# Altium schematic sheet dipping.SchDoc
size A4; SheetNumber: 1; SheetTotal: 1
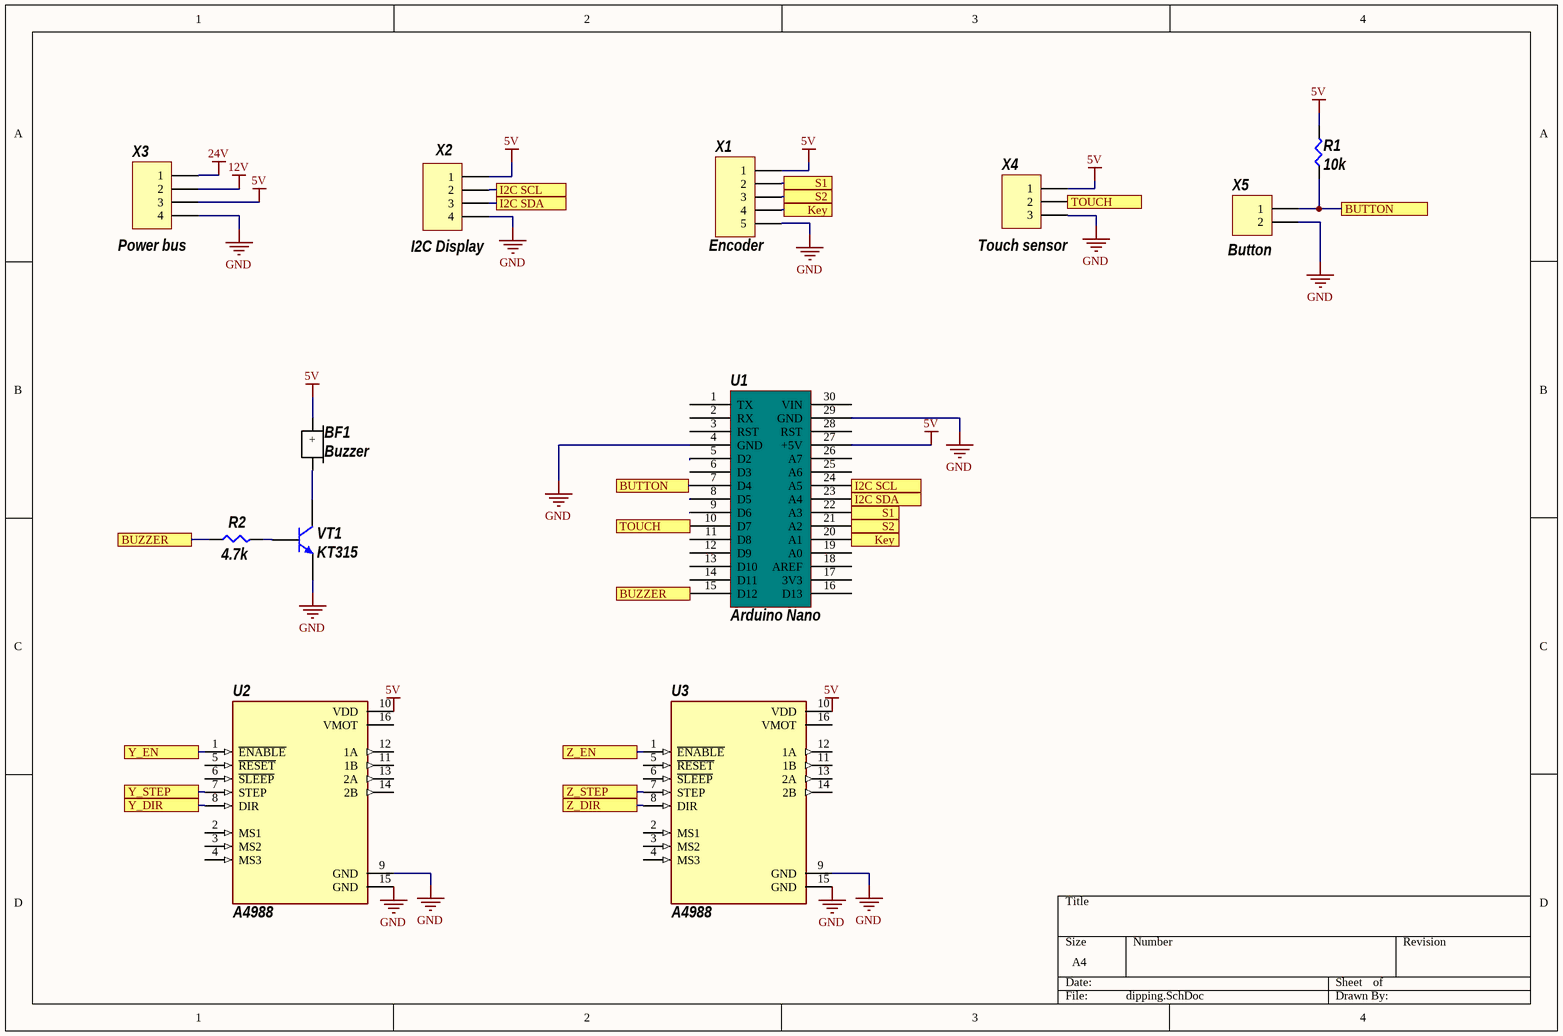
[diagram p0: dipping.SchDoc]

## Parts
BF1  Buzzer  [BUZZER]
R1  10k  [SMD-0805-RES]
R2  4.7k  [SMD-0805-RES]
U1  Arduino Nano  [Arduino_Nano_Extended]
U2  A4988  [UNI_STEPPER_MOTOR_DRIVER_CARRIER]
U3  A4988  [UNI_STEPPER_MOTOR_DRIVER_CARRIER]
VT1  KT315  [TO92]
X1  Encoder  [X_5pins_simplified]
X2  I2C Display  [X_4pins_simplified]
X3  Power bus  [POWER_BUS]
X4  Touch sensor  [X_3pins_simplified]
X5  Button  [X_2pins_5mm]

## Ports
BUTTON, BUZZER, I2C SCL, I2C SDA, Key, S1, S2, TOUCH, Y_DIR, Y_EN, Y_STEP, Z_DIR, Z_EN, Z_STEP

## Nets
5V: BF1.1(+) R1.2 U1.27(+5V) U2.10(VDD) U3.10(VDD) X1.1 X2.1 X3.3 X4.1
12V: X3.2
24V: X3.1
GND: U1.4(GND) U1.29(GND) U2.9(GND) U2.15(GND) U3.9(GND) U3.15(GND) VT1.2(E) X1.5 X2.4 X3.4 X4.3 X5.2
BUTTON: R1.1 U1.7(D4) X5.1 ; port BUTTON
BUZZER: R2.1 U1.15(D12) ; port BUZZER
I2C SCL: U1.24(A5) X2.2 ; port I2C SCL
I2C SDA: U1.23(A4) X2.3 ; port I2C SDA
Key: U1.20(A1) X1.4 ; port Key
S1: U1.22(A3) X1.2 ; port S1
S2: U1.21(A2) X1.3 ; port S2
TOUCH: U1.10(D7) X4.2 ; port TOUCH
Y_DIR: U2.8(DIR) ; port Y_DIR
Y_EN: U2.1(~{ENABLE}) ; port Y_EN
Y_STEP: U2.7(STEP) ; port Y_STEP
Z_DIR: U3.8(DIR) ; port Z_DIR
Z_EN: U3.1(~{ENABLE}) ; port Z_EN
Z_STEP: U3.7(STEP) ; port Z_STEP
NetBF1_2: BF1.2 VT1.3(C)
NetR2_2: R2.2 VT1.1(B)

Not connected (* = marked no-connect by the designer): U1 1(TX) 2(RX) 3(RST) 5(D2) 6(D3) 8(D5) 9(D6) 11(D8) 12(D9) 13(D10) 14(D11) 16(D13) 17(3V3) 18(AREF) 19(A0) 25(A6) 26(A7) 28(RST) 30(VIN); U2 2(MS1) 3(MS2) 4(MS3) 5(~{RESET}) 6(~{SLEEP}) 11(1B) 12(1A) 13(2A) 14(2B) 16(VMOT); U3 2(MS1) 3(MS2) 4(MS3) 5(~{RESET}) 6(~{SLEEP}) 11(1B) 12(1A) 13(2A) 14(2B) 16(VMOT)

## Library data of the parts
BF1 = BF_BUZZER: Value: Buzzer
R1 R2 = ERJ-P06J222V: RES SMD 2.2K OHM 5% 1/2W 0805; Manufacturer: Panasonic Electronic Components; Factory Stock: 0; Unit Price (USD): 0.01839; @ qty: 1500; Minimum Quantity: 1; Power (Watts): 0.5W, 1/2W; Temperature Coefficient: ±200ppm/°C; Part Number: ERJ-P06J222V; Datasheets: https://industrial.panasonic.com/cdbs/www-data/pdf/RDA0000/AOA0000C243.pdf; Image: //media.digikey.com/Renders/Panasonic%20Renders/ERJ-0805%20Pkg.jpg; Digi-Key Part Number: P2.2KADCT-ND; Quantity Available: 53050; Packaging: Cut Tape (CT); Series: ERJ; Part Status: Active; Tolerance: ±5%; Composition: Thick Film; Features: Automotive AEC-Q200, Pulse Withstanding; Operating Temperature: -55°C ~ 155°C; Package / Case: 0805 (2012 Metric); Supplier Device Package: 0805; Size / Dimension: 0.079" L x 0.049" W (2.00mm x 1.25mm); Height - Seated (Max): 0.028" (0.70mm); Number of Terminations: 2; Failure Rate: -
  R1: Value: 10k
  R2: Value: 4.7k
U1 = Arduino_Nano
U2 U3 = A4988_STEPPER_MOTOR_DRIVER_CARRIER: Stepper Motor Driver; MP: A4988 STEPPER MOTOR DRIVER CARRIER; MF: Pololu; Availability: Unavailable; Price: None; Package: None; Value: *; SnapEDA_Link: https://www.snapeda.com/parts/A4988%20STEPPER%20MOTOR%20DRIVER%20CARRIER/Pololu/view-part/1499394/?ref=snap
VT1 = KT315: pin to pad: 2>3 3>2; Type: KT315
X1 = Connector_5pins: Model: *; Manufacture: *; HelpURL: *; Type: Encoder; Case: *
X2 = Connector_4pins: Model: *; Manufacture: *; HelpURL: *; Type: I2C Display; Case: *; Parameter 1: *
X3 = POWER_BUS: Model: *; Manufacture: *; HelpURL: *; Type: Power bus; Case: *
X4 = Connector_3pins: Model: *; Manufacture: *; HelpURL: *; Type: Touch sensor; Case: *
X5 = Connector_2pins: Model: *; Manufacture: *; HelpURL: *; Type: Button; Case: *